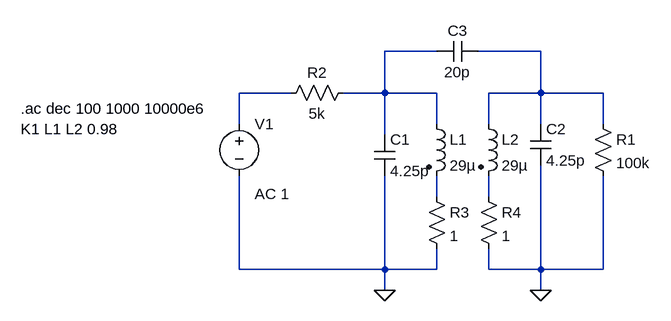
[diagram p0: schematic coupled inductor filter.asc]
coupled inductor filter.asc, the LTspice schematic file:
Version 4
SHEET 1 880 680
WIRE 176 32 96 32
WIRE 336 32 240 32
WIRE -48 96 -128 96
WIRE 96 96 96 32
WIRE 96 96 32 96
WIRE 176 96 96 96
WIRE 336 96 336 32
WIRE 336 96 256 96
WIRE 432 96 336 96
WIRE -128 144 -128 96
WIRE 176 144 176 96
WIRE 256 144 256 96
WIRE 336 144 336 96
WIRE 432 144 432 96
WIRE 96 160 96 96
WIRE 176 256 176 224
WIRE 256 256 256 224
WIRE -128 368 -128 224
WIRE 96 368 96 224
WIRE 96 368 -128 368
WIRE 176 368 176 336
WIRE 176 368 96 368
WIRE 256 368 256 336
WIRE 336 368 336 208
WIRE 336 368 256 368
WIRE 432 368 432 224
WIRE 432 368 336 368
WIRE 96 400 96 368
WIRE 336 400 336 368
FLAG 96 400 0
FLAG 336 400 0
SYMBOL ind2 160 128 R0
SYMATTR InstName L1
SYMATTR Value 29µ
SYMATTR Type ind
SYMATTR SpiceLine Rser=0.5
SYMBOL ind2 240 128 R0
SYMATTR InstName L2
SYMATTR Value 29µ
SYMATTR Type ind
SYMATTR SpiceLine Rser=0.5
SYMBOL cap 80 160 R0
SYMATTR InstName C1
SYMATTR Value 4.25p
SYMBOL cap 320 144 R0
SYMATTR InstName C2
SYMATTR Value 4.25p
SYMBOL res 416 128 R0
SYMATTR InstName R1
SYMATTR Value 100k
SYMBOL res -64 112 R270
WINDOW 0 32 56 VTop 2
WINDOW 3 0 56 VBottom 2
SYMATTR InstName R2
SYMATTR Value 5k
SYMBOL voltage -128 128 R0
WINDOW 123 24 124 Left 2
WINDOW 39 0 0 Left 2
SYMATTR InstName V1
SYMATTR Value ""
SYMATTR Value2 AC 1
SYMBOL cap 176 48 R270
WINDOW 0 32 32 VTop 2
WINDOW 3 0 32 VBottom 2
SYMATTR InstName C3
SYMATTR Value 20p
SYMBOL res 160 240 R0
SYMATTR InstName R3
SYMATTR Value 1
SYMBOL res 240 240 R0
SYMATTR InstName R4
SYMATTR Value 1
TEXT -464 152 Left 2 !K1 L1 L2 0.98
TEXT -464 120 Left 2 !.ac dec 100 1000 10000e6

The netlist it stands for:
* coupled inductor filter.asc
L1 N001 N004 29µ Rser=0.5
L2 N002 N005 29µ Rser=0.5
C1 N001 0 4.25p
C2 N002 0 4.25p
R1 N002 0 100k
R2 N003 N001 5k
V1 N003 0 AC 1
C3 N001 N002 20p
R3 N004 0 1
R4 N005 0 1
K1 L1 L2 0.98
.ac dec 100 1000 10000e6
.backanno
.end